# Altium project ESC_altimeter_v01.PrjPcb
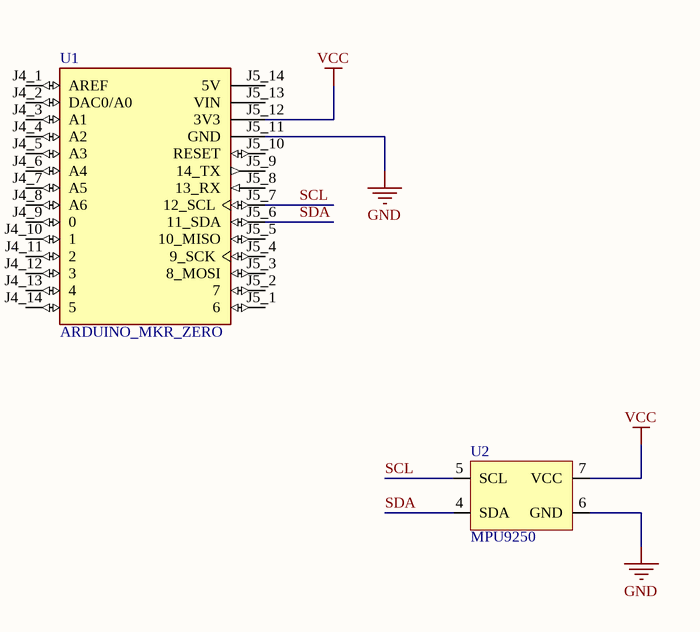
[diagram p0: ESC_altimeter_v01.SchDoc]
1 sheet, 2 parts. Net scope: global (net labels, ports and power ports of the same name join across sheets).
Board file: ESC_altimeter_v01.PcbDoc

## Sheet ESC_altimeter_v01.SchDoc
size A3; SheetNumber: 1; SheetTotal: 1

### Parts
U1  ARDUINO_MKR_ZERO  [MODULE_ARDUINO_MKR_ZERO]
U2  MPU9250  [MPU9250]

### Nets
GND: U1.J5_11(GND) U2.6(GND)
VCC: U1.J5_12(3V3) U2.7(VCC)
SCL: U1.J5_7(12_SCL) U2.5(SCL)
SDA: U1.J5_6(11_SDA) U2.4(SDA)

Not connected (* = marked no-connect by the designer): U1 J4_1(AREF) J4_2(DAC0/A0) J4_3(A1) J4_4(A2) J4_5(A3) J4_6(A4) J4_7(A5) J4_8(A6) J4_9(0) J4_10(1) J4_11(2) J4_12(3) J4_13(4) J4_14(5) J5_1(6) J5_2(7) J5_3(8_MOSI) J5_4(9_SCK) J5_5(10_MISO) J5_8(13_RX) J5_9(14_TX) J5_10(RESET) J5_13(VIN) J5_14(5V)

### Library data of the parts
U1 = ARDUINO_MKR_ZERO: ATSAMD21 Arduino MKR Zero with Headers SAM D ARMÂ® CortexÂ®-M0+ MCU 32-Bit Embedded Evaluation Board; Availability: Unavailable; Check_prices: https://www.snapeda.com/parts/ARDUINO%20MKR%20ZERO/Arduino/view-part/2709581/?ref=eda; SnapEDA_Link: https://www.snapeda.com/parts/ARDUINO%20MKR%20ZERO/Arduino/view-part/2709581/?ref=snap; MF: Arduino; Value: *; Price: None; Package: None; MP: ARDUINO MKR ZERO